# EAGLE design podlewacz_v2 (EAGLE 7.5.0)
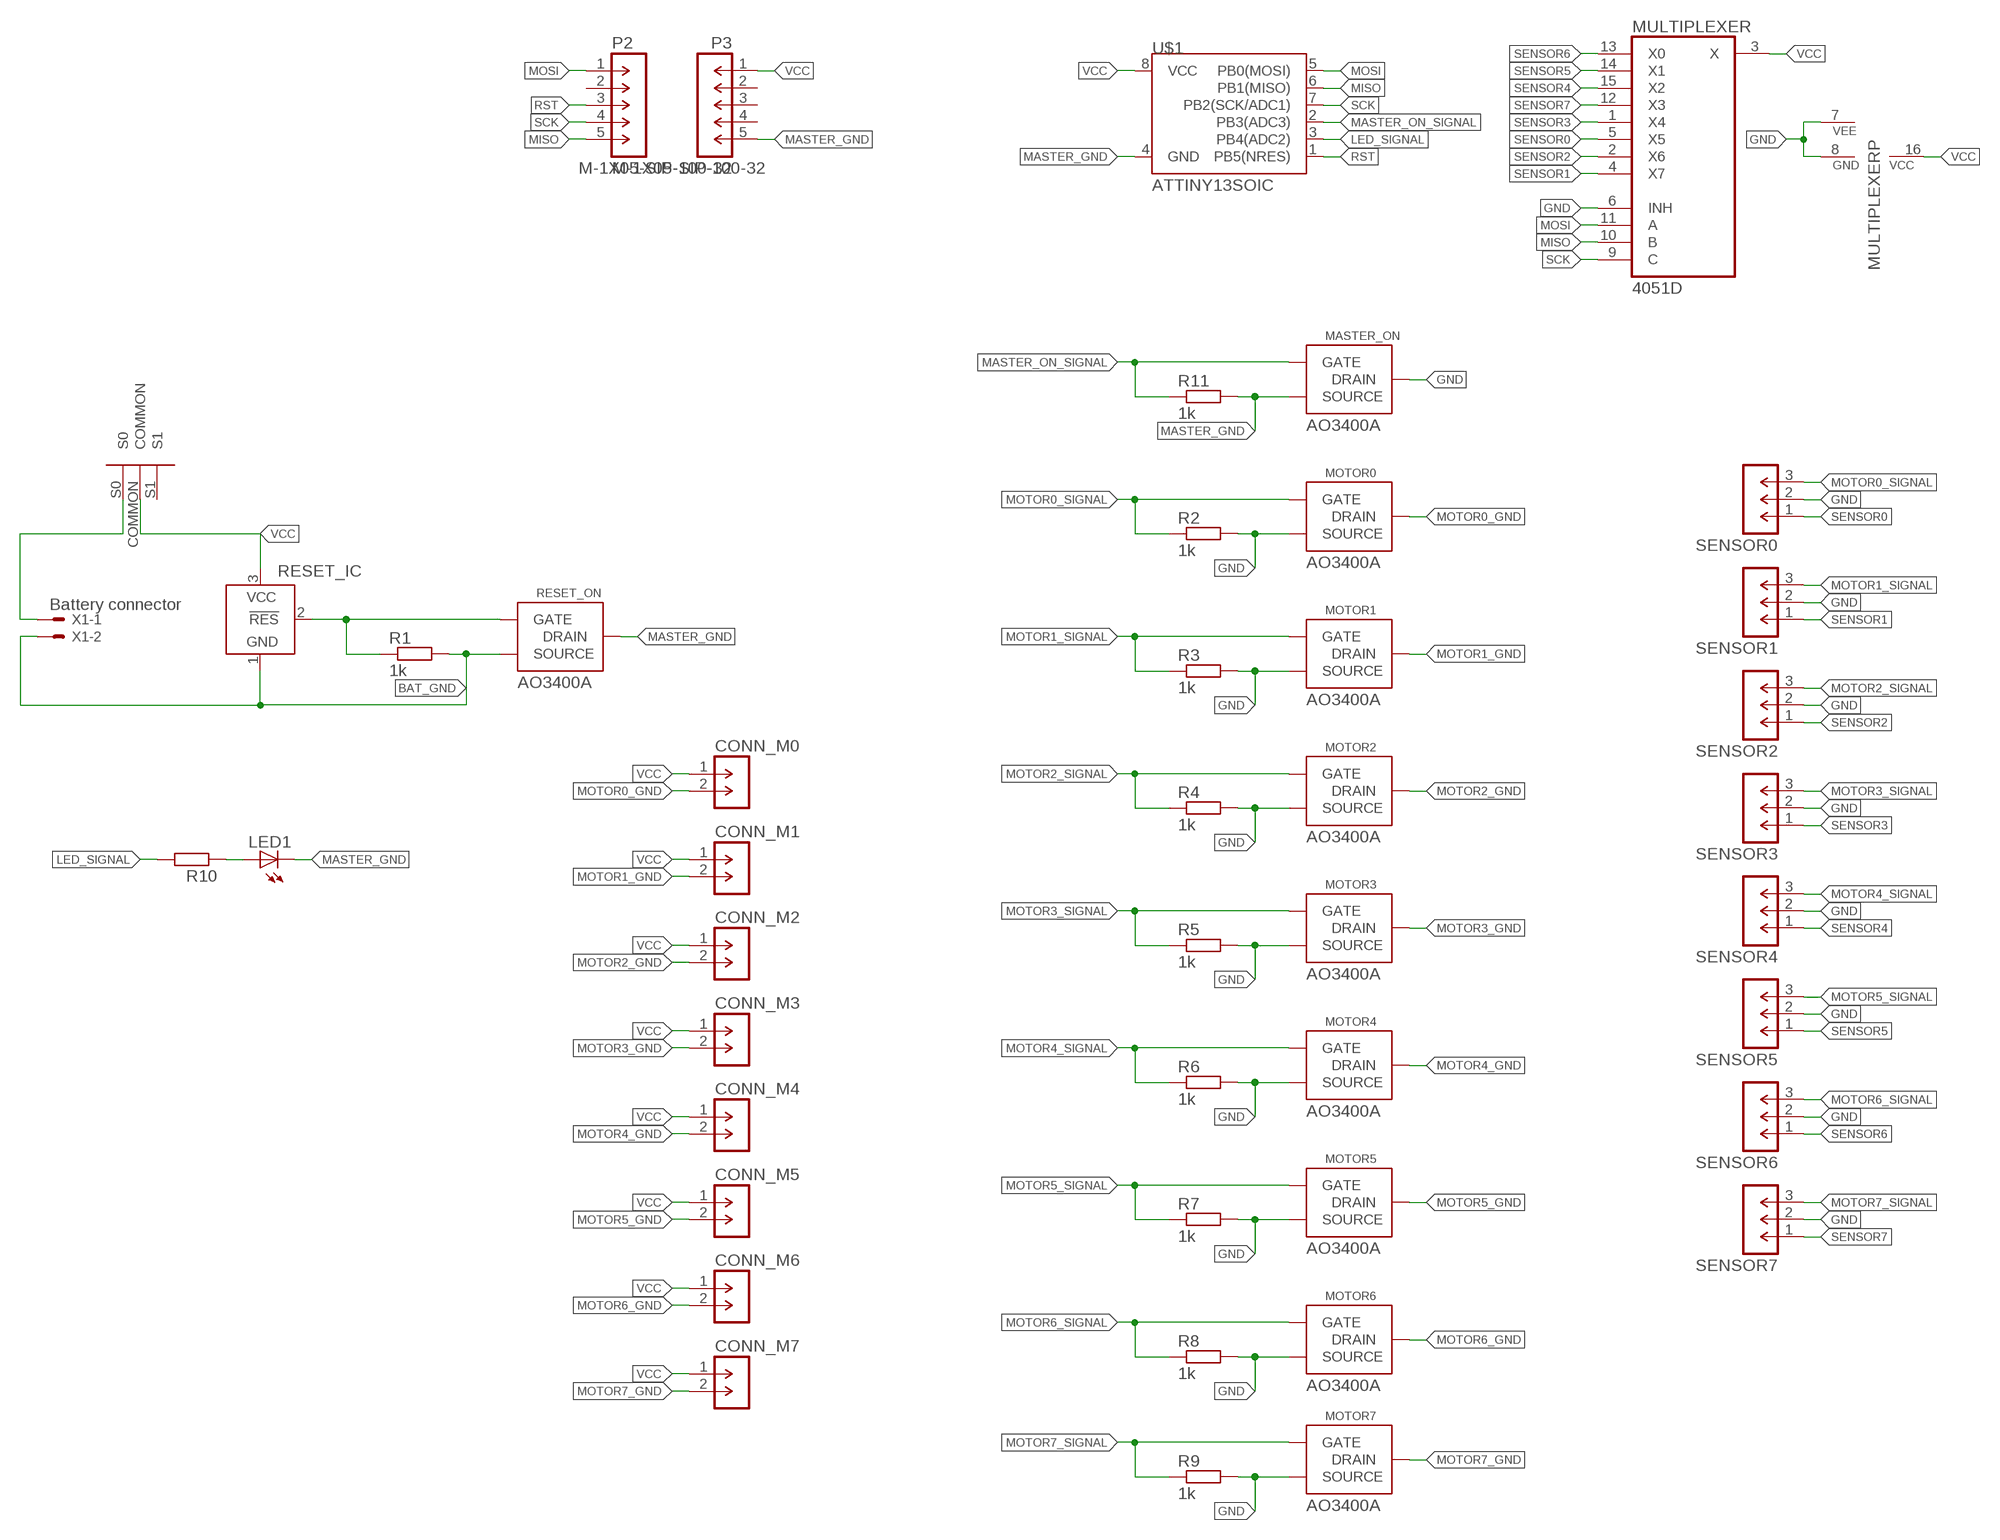
[diagram p0: schematic, sheet 1]

## Parts
CONN_M0  M-1X02-SIP-100-32Y  [SIP-100-02-32Y]
CONN_M1  M-1X02-SIP-100-32Y  [SIP-100-02-32Y]
CONN_M2  M-1X02-SIP-100-32Y  [SIP-100-02-32Y]
CONN_M3  M-1X02-SIP-100-32Y  [SIP-100-02-32Y]
CONN_M4  M-1X02-SIP-100-32Y  [SIP-100-02-32Y]
CONN_M5  M-1X02-SIP-100-32Y  [SIP-100-02-32Y]
CONN_M6  M-1X02-SIP-100-32Y  [SIP-100-02-32Y]
CONN_M7  M-1X02-SIP-100-32Y  [SIP-100-02-32Y]
LED1  LEDCHIP-LED0805  [CHIP-LED0805]
MASTER_ON  AO3400A  [SOT-23]
MOTOR0  AO3400A  [SOT-23]
MOTOR1  AO3400A  [SOT-23]
MOTOR2  AO3400A  [SOT-23]
MOTOR3  AO3400A  [SOT-23]
MOTOR4  AO3400A  [SOT-23]
MOTOR5  AO3400A  [SOT-23]
MOTOR6  AO3400A  [SOT-23]
MOTOR7  AO3400A  [SOT-23]
MULTIPLEXER  4051D  [SO16]
P2  M-1X05-SIP-100-32  [SIP-100-05-32]
P3  M-1X05-SIP-100-32  [SIP-100-05-32]
R1  1k  R-EU_M1206  [M1206]
R2  1k  R-EU_M1206  [M1206]
R3  1k  R-EU_M1206  [M1206]
R4  1k  R-EU_M1206  [M1206]
R5  1k  R-EU_M1206  [M1206]
R6  1k  R-EU_M1206  [M1206]
R7  1k  R-EU_M1206  [M1206]
R8  1k  R-EU_M1206  [M1206]
R9  1k  R-EU_M1206  [M1206]
R10  R-EU_M0805  [M0805]
R11  1k  R-EU_M1206  [M1206]
RESET_IC  TCM809  [SOT23B-3]
RESET_ON  AO3400A  [SOT-23]
SENSOR0  M-1X03-SIP-100-32Y  [SIP-100-03-32Y]
SENSOR1  M-1X03-SIP-100-32Y  [SIP-100-03-32Y]
SENSOR2  M-1X03-SIP-100-32Y  [SIP-100-03-32Y]
SENSOR3  M-1X03-SIP-100-32Y  [SIP-100-03-32Y]
SENSOR4  M-1X03-SIP-100-32Y  [SIP-100-03-32Y]
SENSOR5  M-1X03-SIP-100-32Y  [SIP-100-03-32Y]
SENSOR6  M-1X03-SIP-100-32Y  [SIP-100-03-32Y]
SENSOR7  M-1X03-SIP-100-32Y  [SIP-100-03-32Y]
U$1  ATTINY13SOIC  [SO08]
U$2  SPDT_SLIDE_SWITCH_2_PITCH  [SPDT_SLIDE_SWITCH_2_PITCH]
X1  Battery connector  22-23-2021  [22-23-2021]

## Nets
BAT_GND: R1.2 RESET_IC.1(GND) RESET_ON.2(SOURCE) X1.2
GND: MASTER_ON.3(DRAIN) MOTOR0.2(SOURCE) MOTOR1.2(SOURCE) MOTOR2.2(SOURCE) MOTOR3.2(SOURCE) MOTOR4.2(SOURCE) MOTOR5.2(SOURCE) MOTOR6.2(SOURCE) MOTOR7.2(SOURCE) MULTIPLEXER.6(INH) MULTIPLEXER.7(VEE) MULTIPLEXER.8(GND) R2.2 R3.2 R4.2 R5.2 R6.2 R7.2 R8.2 R9.2 SENSOR0.2 SENSOR1.2 SENSOR2.2 SENSOR3.2 SENSOR4.2 SENSOR5.2 SENSOR6.2 SENSOR7.2
LED_SIGNAL: R10.2 U$1.3(PB4(ADC2))
MASTER_GND: LED1.C MASTER_ON.2(SOURCE) P3.5 R11.2 RESET_ON.3(DRAIN) U$1.4(GND)
MASTER_ON: R1.1 RESET_IC.2(!RES) RESET_ON.1(GATE)
MASTER_ON_SIGNAL: MASTER_ON.1(GATE) R11.1 U$1.2(PB3(ADC3))
MISO: MULTIPLEXER.10(B) P2.5 U$1.6(PB1(MISO))
MOSI: MULTIPLEXER.11(A) P2.1 U$1.5(PB0(MOSI))
MOTOR0_GND: CONN_M0.2 MOTOR0.3(DRAIN)
MOTOR0_SIGNAL: MOTOR0.1(GATE) R2.1 SENSOR0.3
MOTOR1_GND: CONN_M1.2 MOTOR1.3(DRAIN)
MOTOR1_SIGNAL: MOTOR1.1(GATE) R3.1 SENSOR1.3
MOTOR2_GND: CONN_M2.2 MOTOR2.3(DRAIN)
MOTOR2_SIGNAL: MOTOR2.1(GATE) R4.1 SENSOR2.3
MOTOR3_GND: CONN_M3.2 MOTOR3.3(DRAIN)
MOTOR3_SIGNAL: MOTOR3.1(GATE) R5.1 SENSOR3.3
MOTOR4_GND: CONN_M4.2 MOTOR4.3(DRAIN)
MOTOR4_SIGNAL: MOTOR4.1(GATE) R6.1 SENSOR4.3
MOTOR5_GND: CONN_M5.2 MOTOR5.3(DRAIN)
MOTOR5_SIGNAL: MOTOR5.1(GATE) R7.1 SENSOR5.3
MOTOR6_GND: CONN_M6.2 MOTOR6.3(DRAIN)
MOTOR6_SIGNAL: MOTOR6.1(GATE) R8.1 SENSOR6.3
MOTOR7_GND: CONN_M7.2 MOTOR7.3(DRAIN)
MOTOR7_SIGNAL: MOTOR7.1(GATE) R9.1 SENSOR7.3
N$1: U$2.S0 X1.1
N$2: LED1.A R10.1
RST: P2.3 U$1.1(PB5(NRES))
SCK: MULTIPLEXER.9(C) P2.4 U$1.7(PB2(SCK/ADC1))
SENSOR0: MULTIPLEXER.5(X5) SENSOR0.1
SENSOR1: MULTIPLEXER.4(X7) SENSOR1.1
SENSOR2: MULTIPLEXER.2(X6) SENSOR2.1
SENSOR3: MULTIPLEXER.1(X4) SENSOR3.1
SENSOR4: MULTIPLEXER.15(X2) SENSOR4.1
SENSOR5: MULTIPLEXER.14(X1) SENSOR5.1
SENSOR6: MULTIPLEXER.13(X0) SENSOR6.1
SENSOR7: MULTIPLEXER.12(X3) SENSOR7.1
VCC: CONN_M0.1 CONN_M1.1 CONN_M2.1 CONN_M3.1 CONN_M4.1 CONN_M5.1 CONN_M6.1 CONN_M7.1 MULTIPLEXER.3(X) MULTIPLEXER.16(VCC) P3.1 RESET_IC.3(VCC) U$1.8(VCC) U$2.COMMON
Unconnected: P2.2 P3.2 P3.3 P3.4 U$2.S1

## Library data of the parts
CONN_M0 CONN_M1-CONN_M7 = con-headers-jp:M-1X02-: MALE HEADER
LED1 = led:LED: LED OSRAM: - CHIPLED LG R971, LG N971, LY N971, LG Q971, LY Q971, LO R971, LY R971 LH N974, LH R974 LS Q976, LO Q976, LY Q976 LO Q996 - Hyper CHIPLED LW Q18S LB Q993, LB Q99A, LB R99A - SideLED LS A670, LO A670, LY A670, LG A670, LP A670 LB A673, LV A673, LT A673, LW A673 LH A674 LY A675 LS A676, LA A676, LO A676, LY A676, LW A676 LS A679, LY A679, LG A679 - Hyper Micro SIDELED® LS Y876, LA Y876, LO Y876, LY Y876 LT Y87S - SmartLED LW L88C, LW L88S LB L89C, LB L89S, LG L890 LS L89K, LO L89K, LY L89K LS L896, LA L896, LO L896, LY L896 - TOPLED LS T670, LO T670, LY T670, LG T670, LP T670 LSG T670, LSP T670, LSY T670, LOP T670, LYG T670 LG T671, LOG T671, LSG T671 LB T673, LV T673, LT T673, LW T673 LH T674 LS T676, LA T676, LO T676, LY T676, LB T676, LH T676, LSB T676, LW T676 LB T67C, LV T67C, LT T67C, LS T67K, LO T67K, LY T67K, LW E67C LS E67B, LA E67B, LO E67B, LY E67B, LB E67C, LV E67C, LT E67C LW T67C LS T679, LY T679, LG T679 LS T770, LO T770, LY T770, LG T770, LP T770 LB T773, LV T773, LT T773, LW T773 LH T774 LS E675, LA E675, LY E675, LS T675 LS T776, LA T776, LO T776, LY T776, LB T776 LHGB T686 LT T68C, LB T68C - Hyper Mini TOPLED® LB M676 - Mini TOPLED Santana® LG M470 LS M47K, LO M47K, LY M47K Source: http://www.osram.convergy.de LUXEON: - LUMILED® LXK2-PW12-R00, LXK2-PW12-S00, LXK2-PW14-U00, LXK2-PW14-V00 LXK2-PM12-R00, LXK2-PM12-S00, LXK2-PM14-U00 LXK2-PE12-Q00, LXK2-PE12-R00, LXK2-PE12-S00, LXK2-PE14-T00, LXK2-PE14-U00 LXK2-PB12-K00, LXK2-PB12-L00, LXK2-PB12-M00, LXK2-PB14-N00, LXK2-PB14-P00, LXK2-PB14-Q00 LXK2-PR12-L00, LXK2-PR12-M00, LXK2-PR14-Q00, LXK2-PR14-R00 LXK2-PD12-Q00, LXK2-PD12-R00, LXK2-PD12-S00 LXK2-PH12-R00, LXK2-PH12-S00 LXK2-PL12-P00, LXK2-PL12-Q00, LXK2-PL12-R00 Source: www.luxeon.com KINGBRIGHT: KA-3528ASYC Source: www.kingbright.com
MASTER_ON MOTOR0 MOTOR1-MOTOR7 RESET_ON = smd-footprints:AO3400A
MULTIPLEXER = 40xx:4051: 8-channel ANALOG MULTIPLEXER
P2 P3 = con-headers-jp:M-1X05-: MALE HEADER
R1-R11 = resistor:R-EU_: RESISTOR, European symbol
RESET_IC = telcom:TCM809: POWER SUPPLY MONITOR replacement for Maxim MAX809 and MAX810; MF: MICROCHIP; MPN: TCM809MENB713; OC_FARNELL: 9762744; OC_NEWARK: 96K3998
SENSOR0 SENSOR1-SENSOR7 = con-headers-jp:M-1X03-: MALE HEADER
U$1 = SparkFun-DigitalIC:ATTINY13: Atmel 8-pin 1kB flash uC
U$2 = sh4dov lib:SPDT_SLIDE_SWITCH_2_PITCH
X1 = con-molex:22-23-2021: .100" (2.54mm) Center Header - 2 Pin; MF: MOLEX; MPN: 22-23-2021; OC_FARNELL: 1462926; OC_NEWARK: 25C3832

## Board
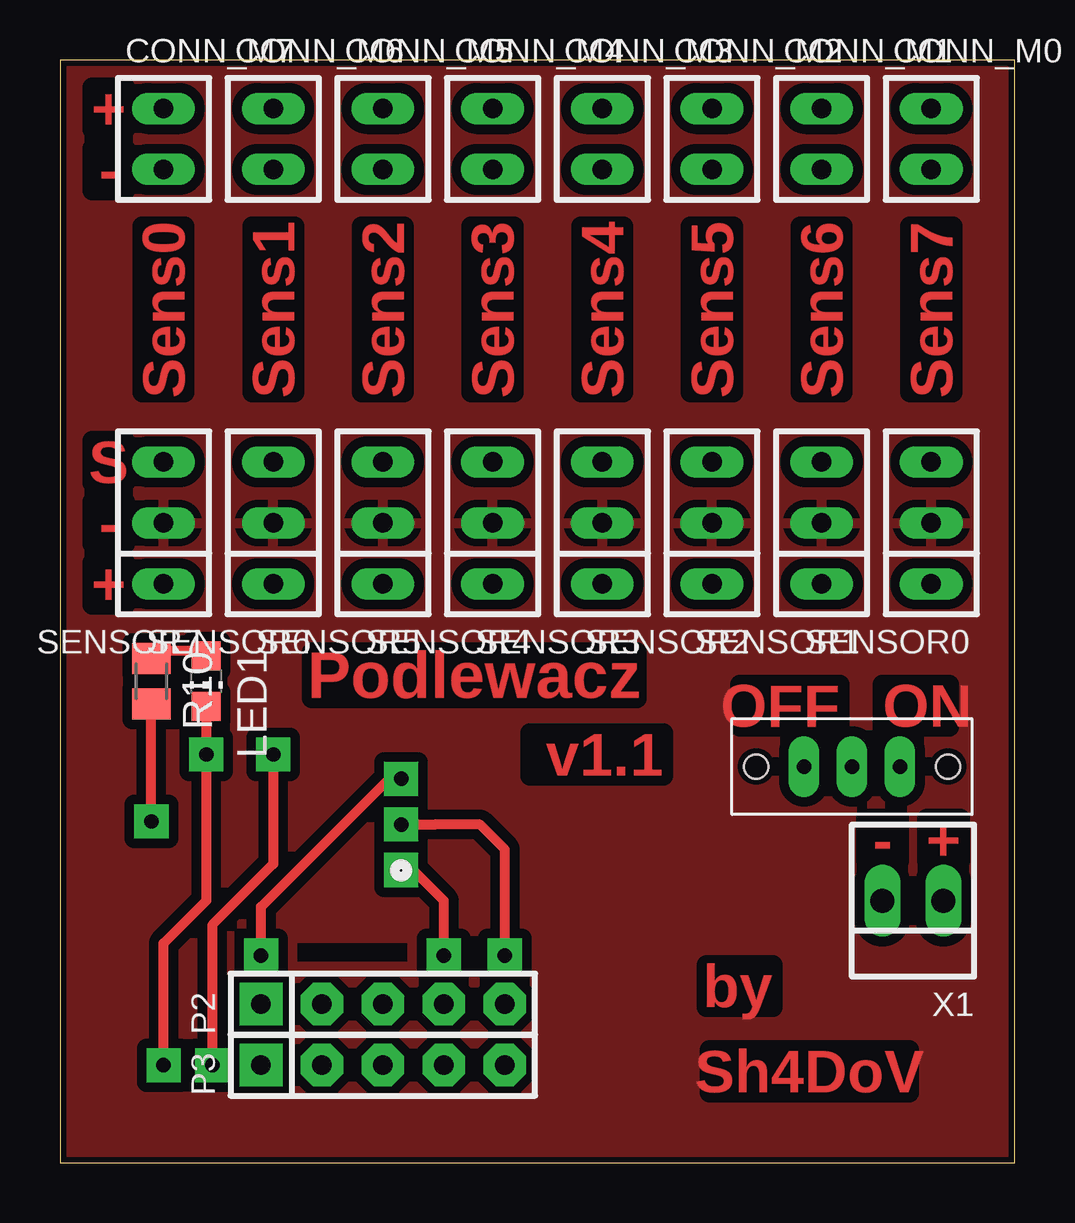
[diagram p1: board, top side]
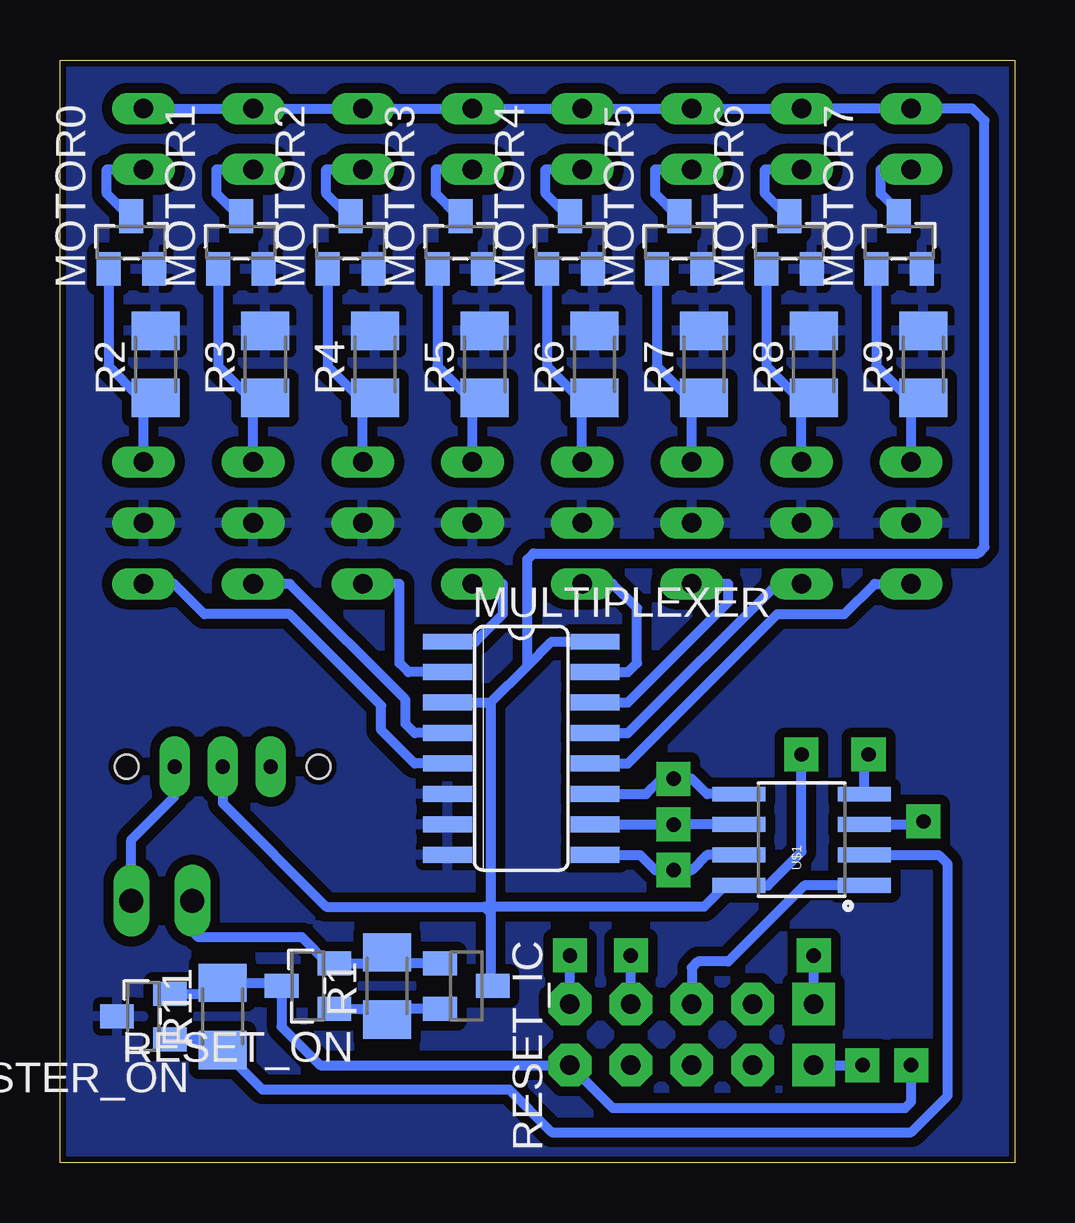
[diagram p2: board, bottom side, seen from below]

Size 39.8 x 45.96 mm. Coordinates in mm from the lower left corner, seen from the top.
Outline: 0,0 39.8,0 39.8,45.96 0,45.96 0,0
Copper layers (1*16): Top 0.035mm / dielectric 1.5mm / Bottom 0.035mm
Design rules "default 16mils": minimum track width 10mil, minimum drill 24mil, track to track 16mil, track to pad 16mil, pad to pad 16mil, via to via 16mil, smd to smd 10mil, copper to edge 10mil, drill to drill 10mil, minimum pad ring 10mil, minimum via ring 8mil, stop-mask expansion 4mil, vias tented up to drill 0mil, thermal gap 12mil
tRestrict: area 9.9,8.4 to 14.5,9.1

### Footprints (pad centres in the part's own frame; a part is rotated, then mirrored left to right if it is on the bottom)
SIP-100-02-32Y = drill 0.813 long: 1 -1.27,0; 2 1.27,0
CHIP-LED0805 = smd 1.2 x 1.2: A 0,-1.05; C 0,1.05
SOT-23 = smd 1 x 1.4: 1 -0.95,-1.1; 2 0.95,-1.1; 3 0,1.1
SO16 = smd 0.66 x 2.032: 1 -4.445,-3.073; 2 -3.175,-3.073; 3 -1.905,-3.073; 4 -0.635,-3.073; 5 0.635,-3.073; 6 1.905,-3.073; 7 3.175,-3.073; 8 4.445,-3.073; 9 4.445,3.073; 10 3.175,3.073; 11 1.905,3.073; 12 0.635,3.073; 13 -0.635,3.073; 14 -1.905,3.073; 15 -3.175,3.073; 16 -4.445,3.073
SIP-100-05-32 = drill 0.813 pad 1.778 square: 1 -5.08,0 | drill 0.813 pad 1.778 octagon: 2 -2.54,0; 3 0,0; 4 2.54,0; 5 5.08,0
M1206 = smd 1.6 x 2: 1 -1.4,0; 2 1.4,0
M0805 = smd 1.3 x 1.6: 1 -0.95,0; 2 0.95,0
SOT23B-3 = smd 1 x 1.4: 1 -0.95,-1.1; 2 0.95,-1.1; 3 0,1.1
SIP-100-03-32Y = drill 0.813 long: 1 -2.54,0; 2 0,0; 3 2.54,0
SO08 = smd 0.61 x 2.21: 1 -1.905,-2.616; 2 -0.635,-2.616; 3 0.635,-2.616; 4 1.905,-2.616; 5 1.905,2.616; 6 0.635,2.616; 7 -0.635,2.616; 8 -1.905,2.616
SPDT_SLIDE_SWITCH_2_PITCH = drill 0.6 pad 1.27 long: COMMON 0,0; S0 -2,0; S1 2,0 | hole 1: -4,0; 4,0
22-23-2021 = drill 1 long: 1 -1.27,0; 2 1.27,0

### Placement (x,y rotation side)
CONN_M0  36.32,42.67 270 top
CONN_M1  31.75,42.67 270 top
CONN_M2  27.18,42.67 270 top
CONN_M3  22.61,42.67 270 top
CONN_M4  18.03,42.67 270 top
CONN_M5  13.46,42.67 270 top
CONN_M6  8.89,42.67 270 top
CONN_M7  4.32,42.67 270 top
LED1  6.1,20.07 180 top
MASTER_ON  36.32,6.1 90 bottom
MOTOR0  36.83,38.35 0 bottom
MOTOR1  32.26,38.35 0 bottom
MOTOR2  27.69,38.35 0 bottom
MOTOR3  23.11,38.35 0 bottom
MOTOR4  18.54,38.35 0 bottom
MOTOR5  13.97,38.35 0 bottom
MOTOR6  9.4,38.35 0 bottom
MOTOR7  4.83,38.35 0 bottom
MULTIPLEXER  20.57,17.27 270 bottom
P2  13.46,6.6 0 top
P3  13.46,4.06 0 top
R1  26.16,7.37 90 bottom
R2  35.81,33.27 90 bottom
R3  31.24,33.27 90 bottom
R4  26.67,33.27 90 bottom
R5  22.1,33.27 90 bottom
R6  17.53,33.27 90 bottom
R7  12.95,33.27 90 bottom
R8  8.38,33.27 90 bottom
R9  3.81,33.27 90 bottom
R10  3.81,20.07 270 top
R11  33.02,6.1 90 bottom
RESET_IC  22.86,7.37 270 bottom
RESET_ON  29.46,7.37 90 bottom
SENSOR0  36.32,26.67 90 top
SENSOR1  31.75,26.67 90 top
SENSOR2  27.18,26.67 90 top
SENSOR3  22.61,26.67 90 top
SENSOR4  18.03,26.67 90 top
SENSOR5  13.46,26.67 90 top
SENSOR6  8.89,26.67 90 top
SENSOR7  4.32,26.67 90 top
U$1  8.89,13.46 90 bottom
U$2  33.02,16.51 180 top
X1  35.56,10.92 180 top

### Tracks (layer width: path | path; a pad name or v marks a point on that pad's centre or on a via)
BAT_GND
  Bottom 0.406: 26.16,8.32 R1.2 | RESET_IC.1 25.71,8.32 R1.2 | R1.2 26.61,8.32 RESET_ON.2 28.64,8.32 29.72,9.4 34.04,9.4 34.29,9.65 X1.2
GND
  pour Bottom: 0,45.97 39.88,45.97 39.88,0 0,0
  pour Top: 0,45.97 39.88,45.97 39.88,0 0,0
LED_SIGNAL  (via drill 0.6 pad 1.42)
  Top 0.406: v3.81,14.22 R10.2
  Bottom 0.406: U$1.3 3.94,14.1 v3.81,14.22
MASTER_GND  (via drill 0.6 pad 1.42)
  Top 0.406: v4.32,4.06 4.32,9.14 6.1,10.92 v6.1,17.02 LED1.C
  Bottom 0.406: MASTER_ON.2 33.47,7.05 R11.2 30.69,7.5 RESET_ON.3 30.56,5.67 28.96,4.06 P3.5 | U$1.4 6.27,16.84 v6.1,17.02 | v4.32,4.06 4.32,2.54 4.57,2.29 16.76,2.29 P3.5 | P3.5 18.54,3.81
MASTER_ON
  Bottom 0.406: 26.16,6.42 R1.1 | RESET_IC.2 25.71,6.42 R1.1 | RESET_ON.1 26.61,6.42 R1.1
MASTER_ON_SIGNAL
  Bottom 0.406: MASTER_ON.1 33.47,5.15 R11.1 31.37,3.05 21.08,3.05 19.3,1.27 4.32,1.27 2.79,2.79 2.79,12.45 3.17,12.83 U$1.2
MISO  (via drill 0.6 pad 1.42)
  Top 0.406: v14.22,14.1 14.73,14.1 15.62,14.1 MULTIPLEXER.10 18.54,13.06 v18.54,8.64
  Bottom 0.406: MULTIPLEXER.10 v14.22,14.1 U$1.6 | P2.5 v18.54,8.64
MOSI  (via drill 0.6 pad 1.42)
  Top 0.406: v8.38,8.64 8.38,10.67 13.72,16 v14.22,16
  Bottom 0.406: MULTIPLEXER.11 15.37,15.37 14.73,16 v14.22,16 13.46,16 12.83,15.37 U$1.5 | P2.1 v8.38,8.64
MOTOR0_GND
  Bottom 0.406: MOTOR0.3 36.91,39.45 37.85,40.39 37.85,41.4 CONN_M0.2
MOTOR0_SIGNAL
  Bottom 0.406: SENSOR0.3 36.32,31.37 R2.1 35.94,32 36.58,32 37.78,33.21 MOTOR0.1
MOTOR1_GND
  Bottom 0.406: MOTOR1.3 32.34,39.45 33.27,40.39 33.27,41.4 CONN_M1.2
MOTOR1_SIGNAL
  Bottom 0.406: SENSOR1.3 31.75,31.37 R3.1 31.37,31.75 31.75,31.75 33.21,33.21 MOTOR1.1
MOTOR2_GND
  Bottom 0.406: MOTOR2.3 27.77,39.45 28.7,40.39 28.7,41.4 CONN_M2.2
MOTOR2_SIGNAL
  Bottom 0.406: SENSOR2.3 27.18,31.37 R4.1 26.8,32 27.43,32 28.64,33.21 MOTOR2.1
MOTOR3_GND
  Bottom 0.406: MOTOR3.3 23.2,39.45 24.13,40.39 24.13,41.4 CONN_M3.2
MOTOR3_SIGNAL
  Bottom 0.406: SENSOR3.3 22.61,31.37 R5.1 22.23,32 22.86,32 24.06,33.21 MOTOR3.1
MOTOR4_GND
  Bottom 0.406: MOTOR4.3 18.63,39.45 19.56,40.39 19.56,41.4 CONN_M4.2
MOTOR4_SIGNAL
  Bottom 0.406: SENSOR4.3 18.03,31.37 R6.1 17.65,31.75 18.03,31.75 19.49,33.21 MOTOR4.1
MOTOR5_GND
  Bottom 0.406: MOTOR5.3 14.05,39.45 14.99,40.39 14.99,41.4 CONN_M5.2
MOTOR5_SIGNAL
  Bottom 0.406: SENSOR5.3 13.46,31.37 R7.1 13.08,31.75 13.46,31.75 14.92,33.21 MOTOR5.1
MOTOR6_GND
  Bottom 0.406: MOTOR6.3 9.48,39.45 10.41,40.39 10.41,41.4 CONN_M6.2
MOTOR6_SIGNAL
  Bottom 0.406: SENSOR6.3 8.89,31.37 R8.1 8.51,31.75 8.89,31.75 10.35,33.21 MOTOR6.1
MOTOR7_GND
  Bottom 0.406: MOTOR7.3 4.83,39.62 5.59,40.39 5.59,41.4 CONN_M7.2
MOTOR7_SIGNAL
  Bottom 0.406: SENSOR7.3 4.32,31.37 R9.1 3.93,31.75 4.32,31.75 5.78,33.21 MOTOR7.1
N$1
  Bottom 0.406: X1.1 36.83,13.46 35.05,15.24 35.05,16.48 U$2.S0
N$2
  Top 0.406: 4.16,21.12 R10.1 4.13,21.34 5.84,21.34 6.06,21.12 LED1.A
N$3
  pour Bottom: 0,0 39.88,0 39.88,45.97 0,45.97
N$5
  pour Top: 0,0 39.88,0 39.88,45.97 0,45.97
RST
  Bottom 0.406: U$1.1 8.76,11.56 11.94,8.38 13.21,8.38 13.46,8.13 P2.3
SCK  (via drill 0.6 pad 1.42)
  Top 0.406: v14.22,12.19 14.73,12.19 16,10.92 v16,8.64
  Bottom 0.406: MULTIPLEXER.9 15.62,12.83 14.99,12.19 v14.22,12.19 13.46,12.19 12.83,12.83 U$1.7 | P2.4 v16,8.64
SENSOR0
  Bottom 0.406: MULTIPLEXER.5 25.02,16.64 26.42,18.03 26.42,19.05 30.23,22.86 33.78,22.86 35.05,24.13 SENSOR0.1
SENSOR1
  Bottom 0.406: MULTIPLEXER.4 25.02,17.91 25.4,18.29 25.4,19.3 30.23,24.13 SENSOR1.1
SENSOR2
  Bottom 0.406: MULTIPLEXER.2 25.27,20.45 25.65,20.83 25.65,24.13 SENSOR2.1
SENSOR3
  Bottom 0.406: MULTIPLEXER.1 22.48,21.72 21.34,22.86 21.34,24.13 SENSOR3.1
SENSOR4
  Bottom 0.406: MULTIPLEXER.15 16.13,20.45 15.75,20.83 15.75,23.11 16.76,24.13 SENSOR4.1
SENSOR5
  Bottom 0.406: MULTIPLEXER.14 16.13,19.18 11.94,23.37 11.94,24.13 SENSOR5.1
SENSOR6
  Bottom 0.406: MULTIPLEXER.13 16.13,17.91 9.91,24.13 SENSOR6.1
SENSOR7
  Bottom 0.406: MULTIPLEXER.12 16.13,16.64 9.91,22.86 7.11,22.86 5.84,24.13 SENSOR7.1
VCC  (via drill 0.6 pad 1.42)
  Top 0.406: v8.89,17.02 8.89,12.45 6.35,9.91 v6.35,4.06
  Bottom 0.406: CONN_M0.1 CONN_M1.1 CONN_M2.1 CONN_M3.1 CONN_M4.1 CONN_M5.1 CONN_M6.1 CONN_M7.1 1.78,43.94 1.27,43.43 1.27,25.65 1.52,25.4 20.07,25.4 20.32,25.15 20.32,20.7 | 20.32,20.7 21.84,19.18 MULTIPLEXER.3 21.97,19.18 21.84,19.05 21.84,10.67 | 20.32,20.7 19.3,21.72 MULTIPLEXER.16 | 21.84,10.67 21.84,10.41 | 21.84,10.41 21.84,7.45 RESET_IC.3 | 21.84,10.67 12.95,10.67 12.07,11.56 U$1.8 10.29,11.56 8.89,12.95 v8.89,17.02 | P3.1 v6.35,4.06 | U$2.COMMON 33.02,14.99 28.7,10.67 22.1,10.67 21.84,10.41

### Text on the board
Top: + | - | Sens0 | Sens1 | Sens2 | Sens3 | Sens4 | Sens5 | Sens6 | Sens7 | S | - | + | Podlewacz | OFF | ON | v1.1 | - | + | by | Sh4DoV